# EasyEDA schematic PCB Timbangan.json
TITLE: Sheet_1; REV: 1.0; Date: 2023-10-11; Sheet: 1/1; Company: Your Company
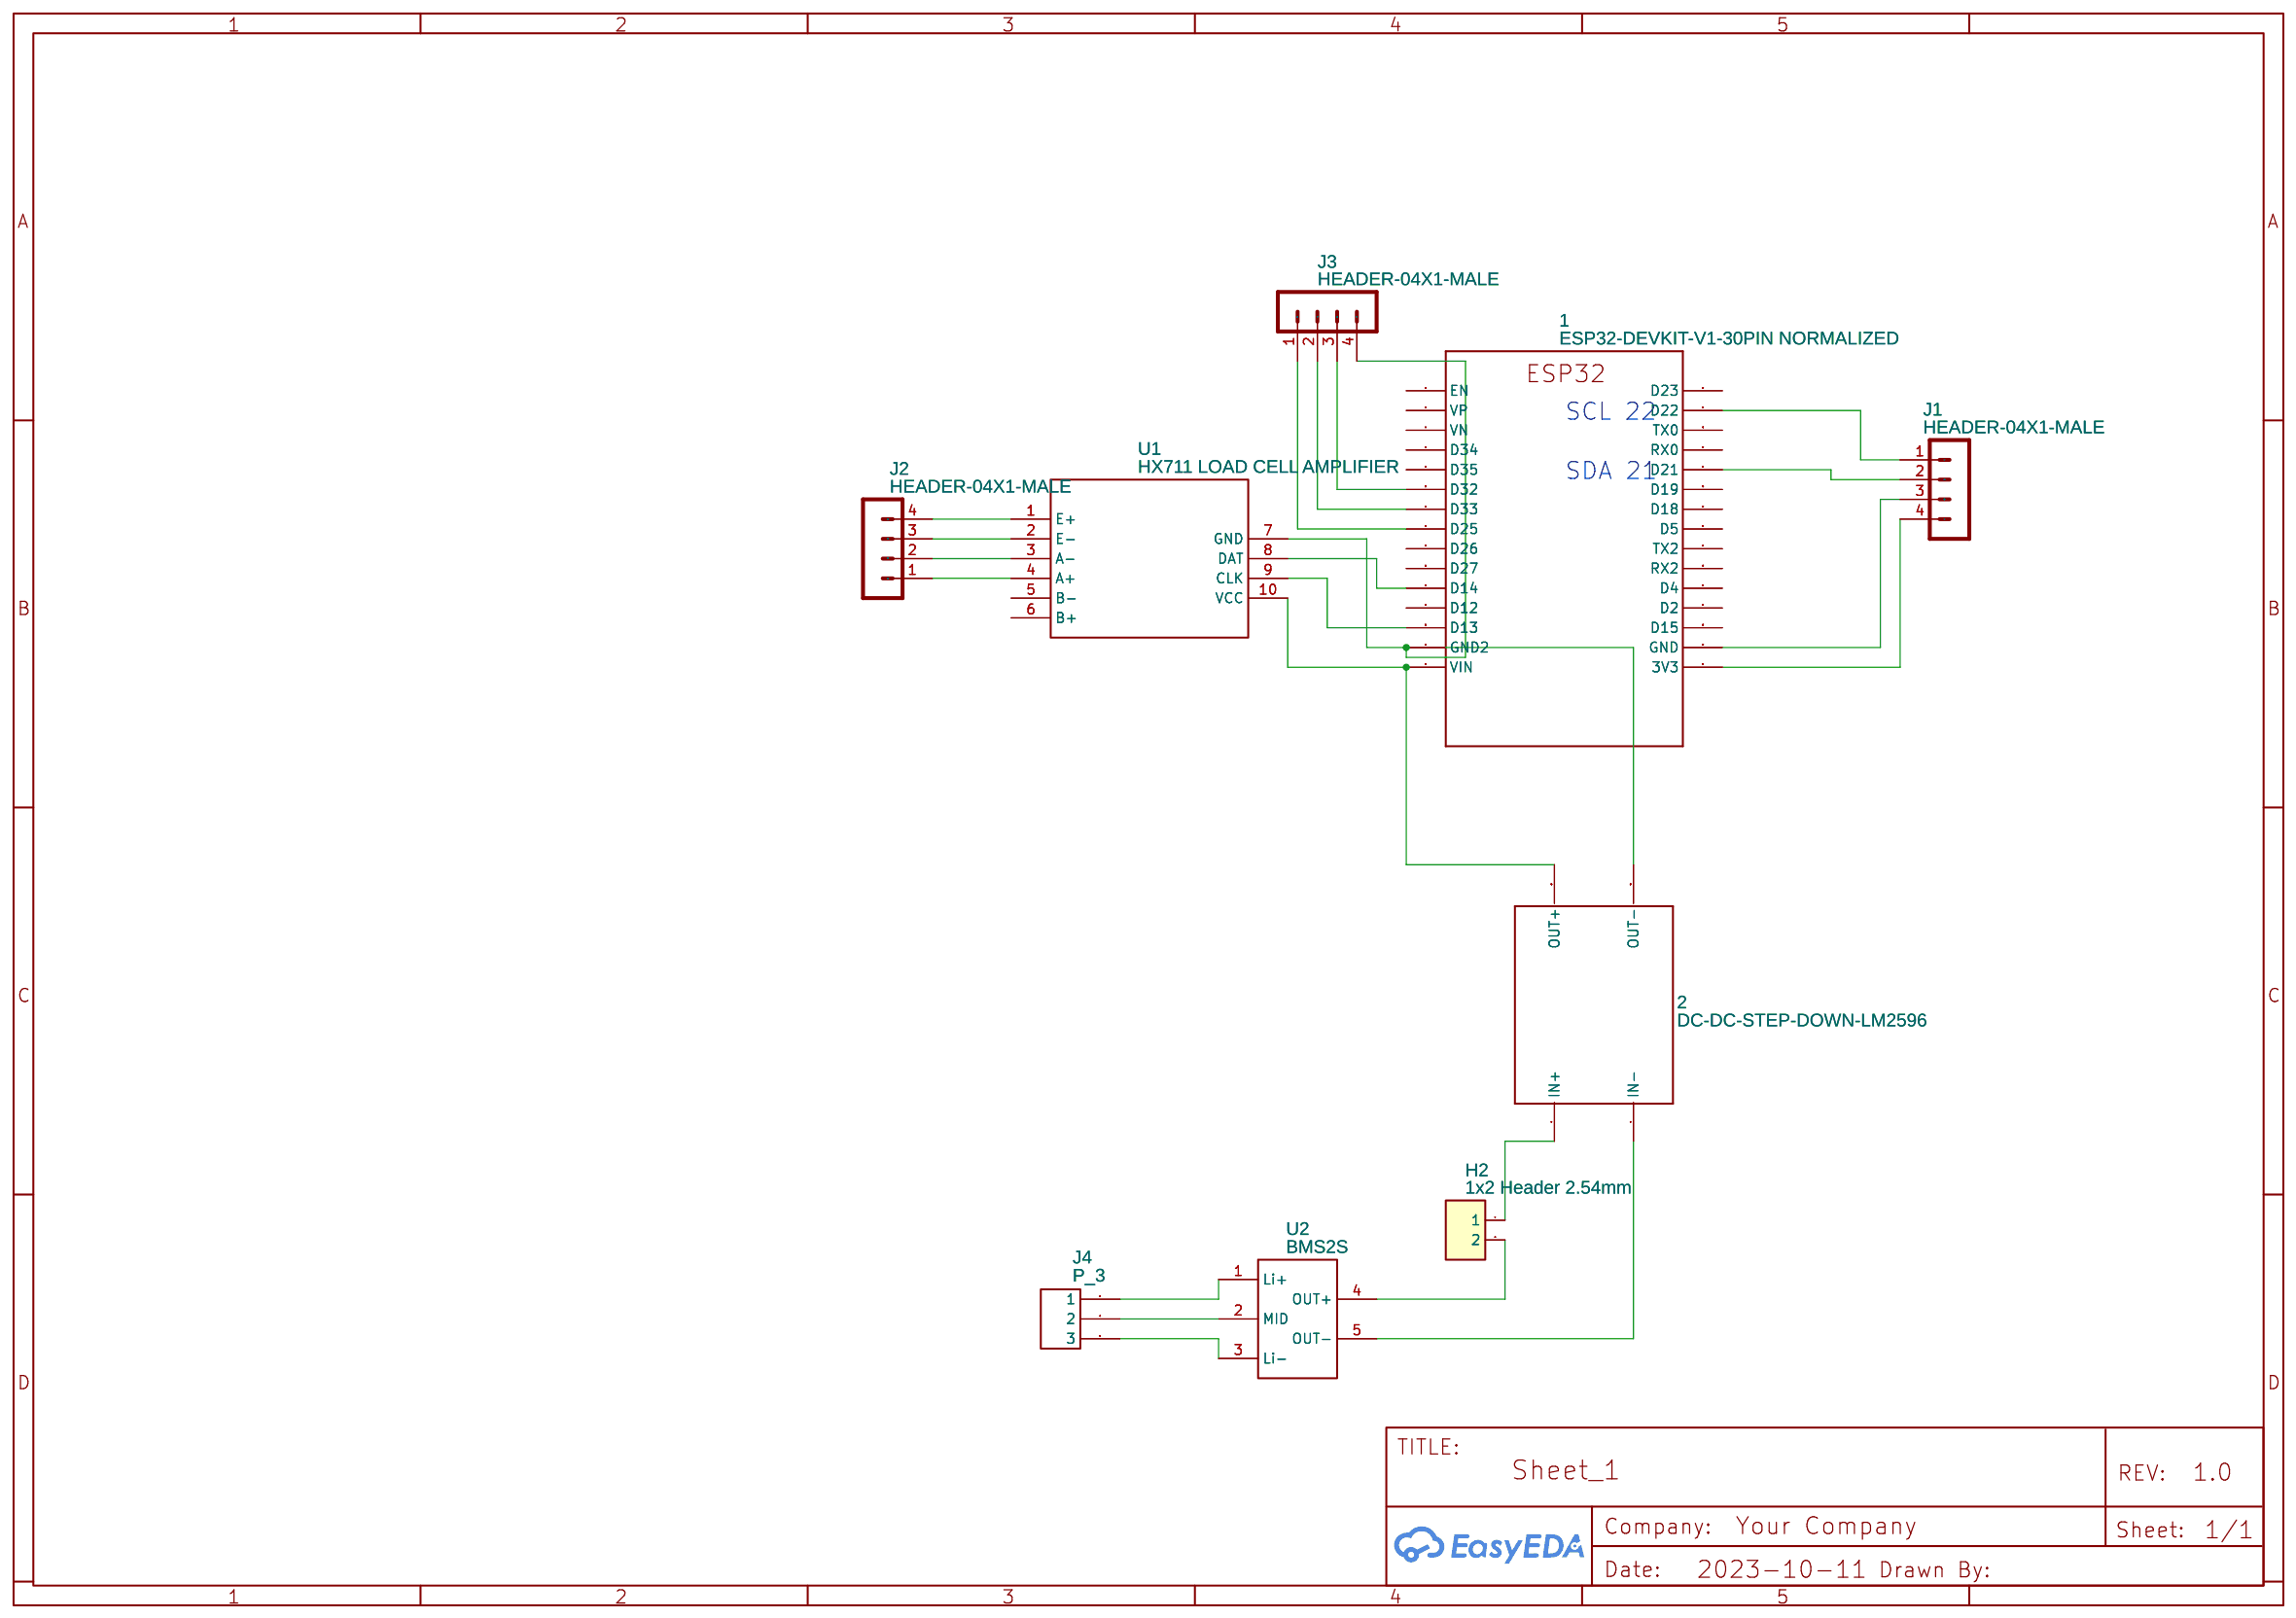
[diagram p0: schematic sheet]

## Parts
1  ESP32-DEVKIT-V1-30PIN NORMALIZED  [ESP32-DEVKITV1_ESP32-DEVKITV1]
2  DC-DC-STEP-DOWN-LM2596  [DC-DC-STEP-DOWN-LM2596]
H2  1x2 Header 2.54mm  [HEADER_2]
J1  HEADER-04X1-MALE  [PINHEADER_04X1_MALE]
J2  HEADER-04X1-MALE  [PINHEADER_04X1_MALE]
J3  HEADER-04X1-MALE  [PINHEADER_04X1_MALE]
J4  P_3  [HDR1X3]
U1  HX711 LOAD CELL AMPLIFIER  [HX711 LOAD CELL AMPLIFIER HX711 BREAKOUT]
U2  BMS2S  [BMS2S]

## Library data of the parts
1 = ESP32-DEVKIT-V1-30PIN: Contributor: KiraKira san
2 = DC-DC-STEP-DOWN-LM2596: Contributor: Lorenz Hohn
H2 = 1x2 Header 2.54mm: Manufacturer Part: New SchematicLib; Contributor: PedroM
J1-J3 = HEADER-04X1-MALE: 4 x 0.1 inch Header Male; Contributor: SparkFun
J4 = P_3: sourceId: jX5ZhbR93; Contributor: abidmuhd00
U1 = HX711 LOAD CELL AMPLIFIER: Contributor: Dev 91
U2 = BMS2S: Contributor: dimazi

## Nets
Net-(1-3V3): 1.3V3 J1.4
Net-(1-D13): 1.D13 U1.9(CLK)
Net-(1-D14): 1.D14 U1.8(DAT)
Net-(1-D21): 1.D21 J1.2
Net-(1-D22): 1.D22 J1.1
Net-(1-D25): 1.D25 J3.1
Net-(1-D32): 1.D32 J3.3
Net-(1-D33): 1.D33 J3.2
Net-(1-GND2): 1.GND2 2.OUT- J3.4 U1.7(GND)
Net-(1-GND): 1.GND J1.3
Net-(1-VIN): 1.VIN 2.OUT+ U1.10(VCC)
Net-(2-IN+): 2.IN+ H2.1
Net-(2-IN-): 2.IN- U2.5(OUT-)
Net-(H2-2): H2.2 U2.4(OUT+)
Net-(J2-1): J2.1 U1.4(A+)
Net-(J2-2): J2.2 U1.3(A-)
Net-(J2-3): J2.3 U1.2(E-)
Net-(J2-4): J2.4 U1.1(E+)
Net-(J4-1): J4.1 U2.1(Li+)
Net-(J4-2): J4.2 U2.2(MID)
Net-(J4-3): J4.3 U2.3(Li-)

Not connected (* = marked no-connect by the designer): 1 D2 D4 D5 D12 D15 D18 D19 D23 D26 D27 D34 D35 EN RX0 RX2 TX0 TX2 VN VP; U1 5(B-) 6(B+)

## Notes on the sheet
- SCL 22
- SDA 21
